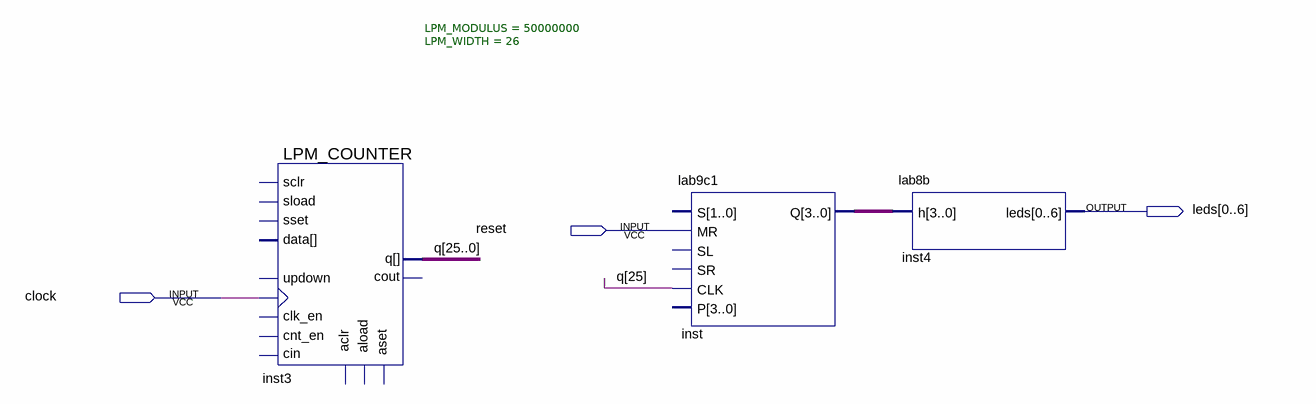
[diagram p0: schematic sheet]
// Quartus schematic lab9c2.bdf as structural Verilog: 3 symbols, 3 pins
module lab9c2 (
  input  reset,
  input  clock,
  output [0:6] leds
);

  wire [3:0] inst_q;
  wire [25:0] q;

  LPM_COUNTER #(.LPM_MODULUS(50000000), .LPM_WIDTH(26)) inst3 (
    .clock(clock), .q(q));  // open: sload, data, clk_en, aload, aclr, aset, cin, sset, updown, cnt_en, sclr, cout
  lab9c1 inst (.MR(reset), .CLK(q[25]), .Q(inst_q));  // open: S, SL, SR, P
  lab8b inst4 (.h(inst_q), .leds(leds));
endmodule
